# Altium schematic sheet 06 MCU_PORT.SchDoc
size 513 x 386 mm
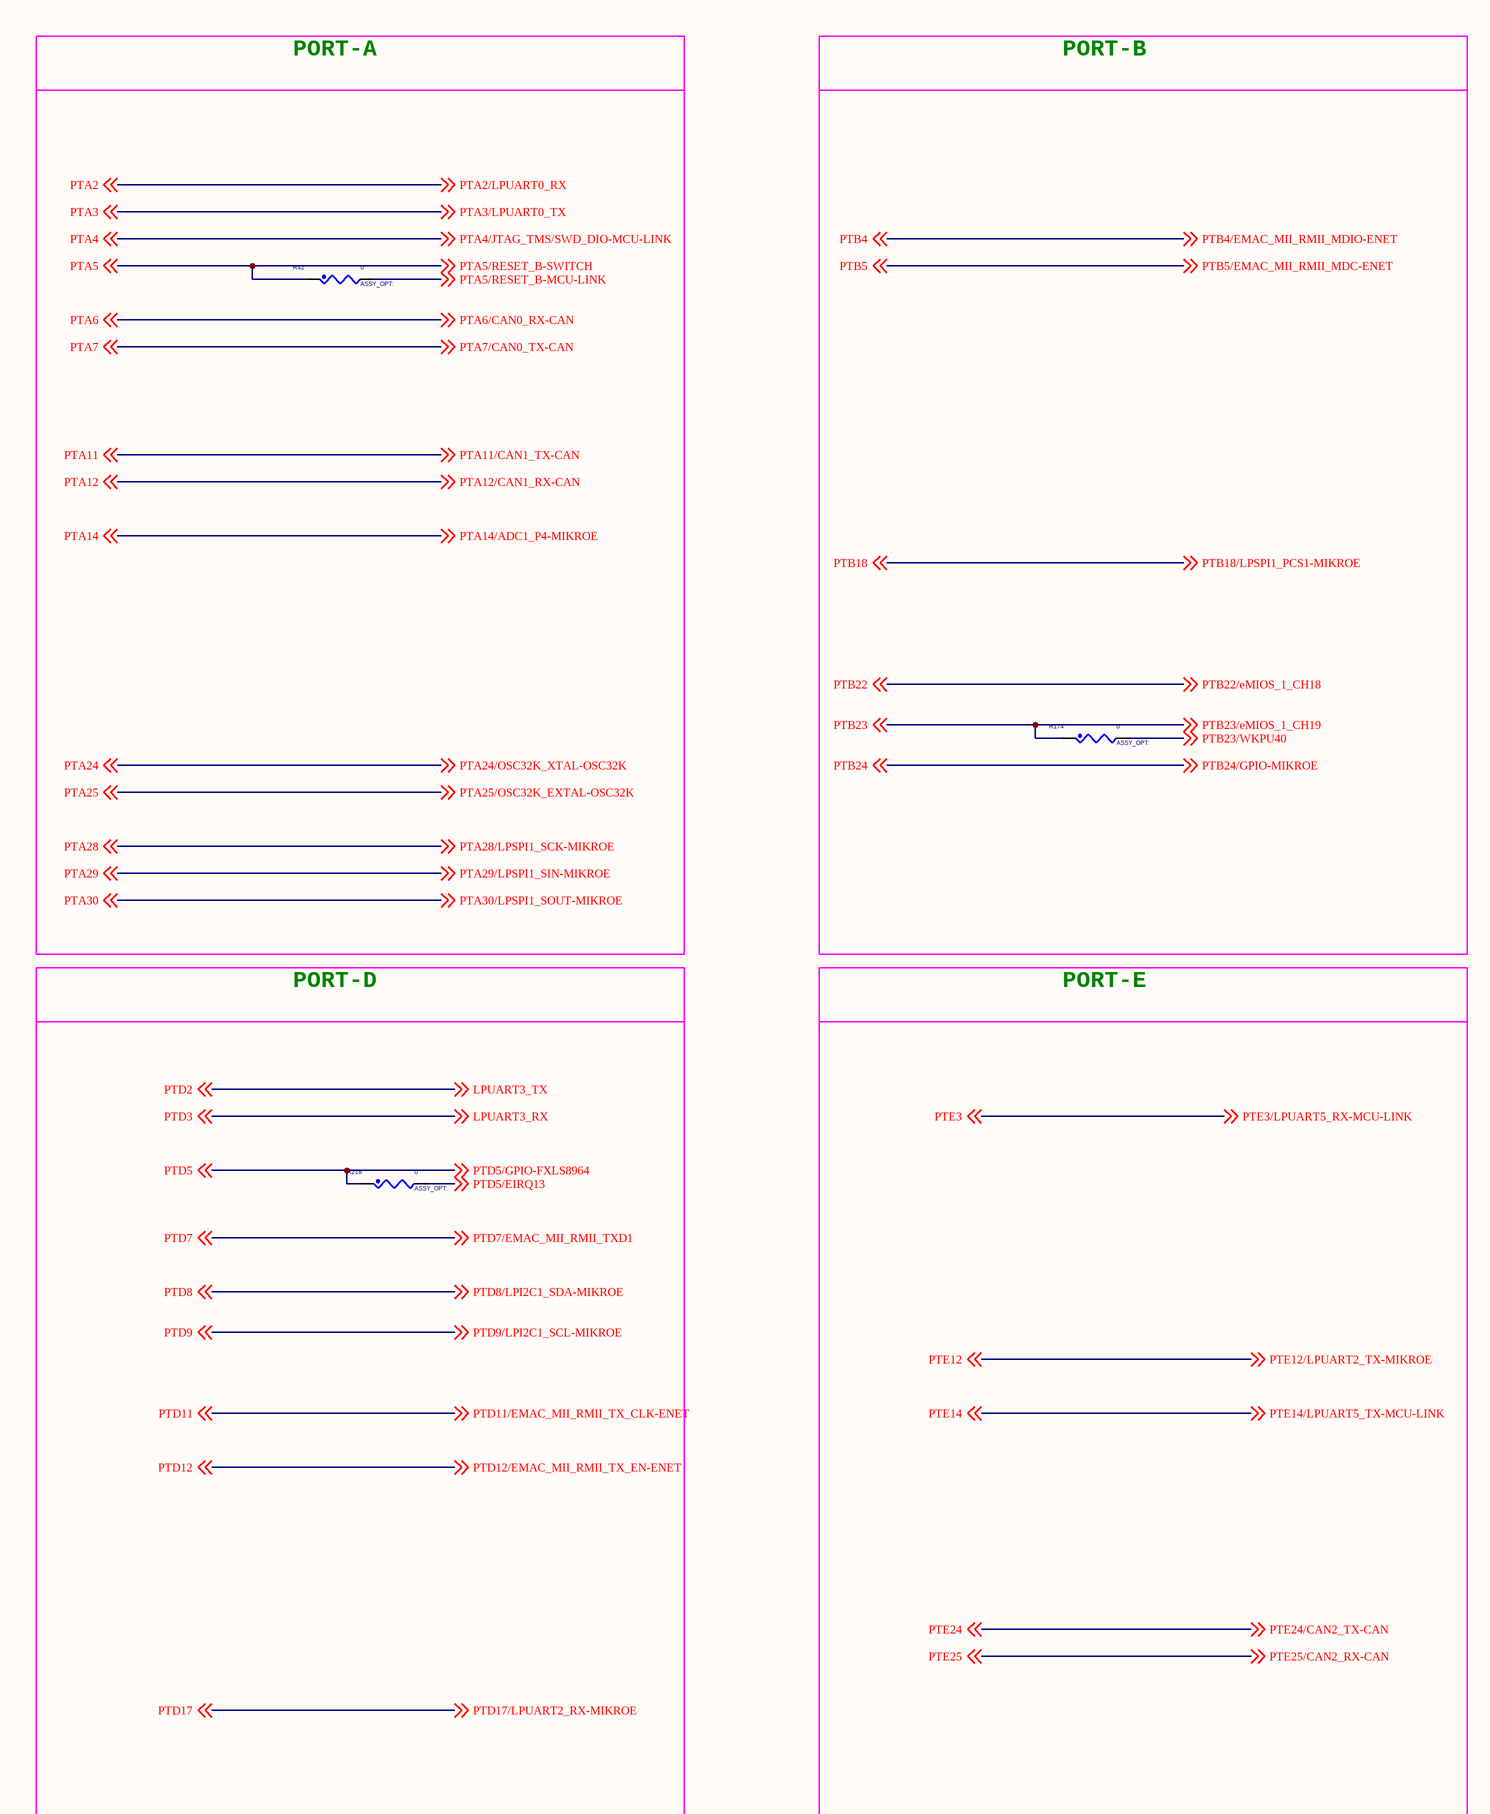
[diagram p0: 06 MCU_PORT.SchDoc, left]
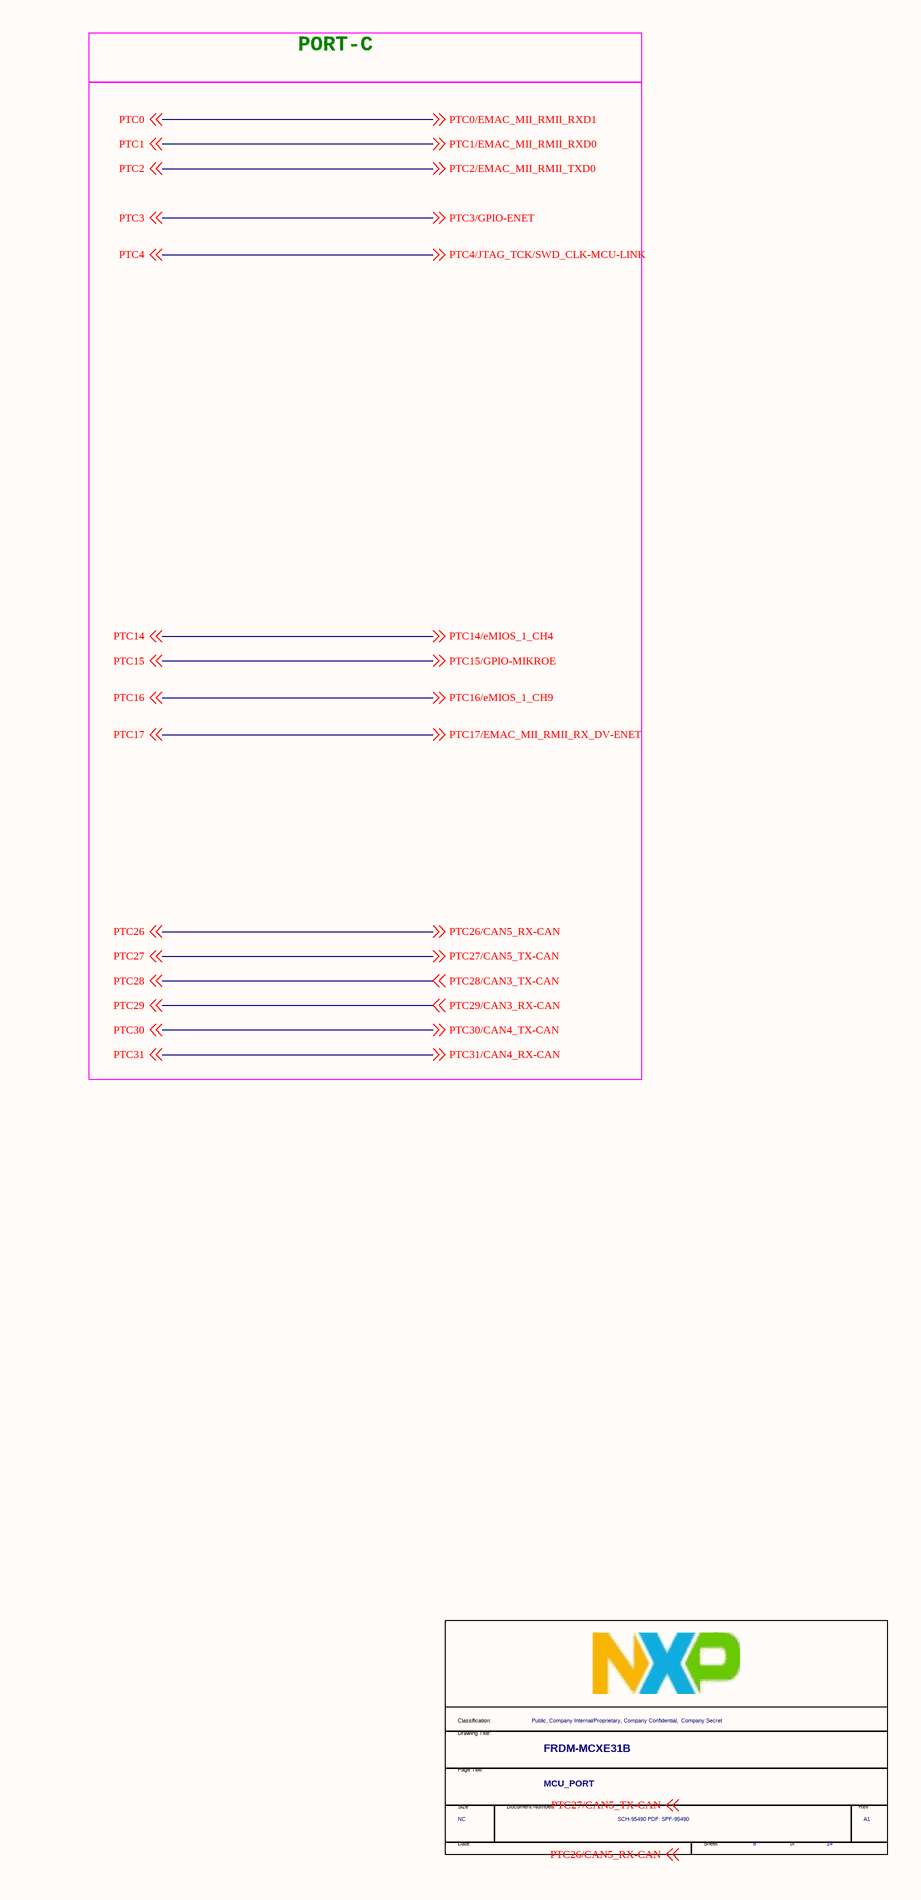
[diagram p1: 06 MCU_PORT.SchDoc, right]

## Parts
*  Title: FRDM-MCXE31B  RevCode: A1  PageTitle: MCU_PORT  Page Size: NC  Page Number: 6  Page Count: 14  Doc: SCH-95490 PDF: SPF-95490  Classification: Public, Company Internal/Proprietary, Company Confidential,  Company Secret  (hidden comment: TitleBlock_FS)  (graphical)
R42  0  [RC0402_25]
R174  0  [RC0603_OV]
R218  0  [RC0603_OV]

## Nets
LPUART3_RX: off-sheet PTD3, off-sheet LPUART3_RX  [also labelled PTD3]
LPUART3_TX: off-sheet PTD2, off-sheet LPUART3_TX  [also labelled PTD2]
PTA2: off-sheet PTA2, off-sheet PTA2/LPUART0_RX  [also labelled PTA2/LPUART0_RX]
PTA3: off-sheet PTA3, off-sheet PTA3/LPUART0_TX  [also labelled PTA3/LPUART0_TX]
PTA4: off-sheet PTA4, off-sheet PTA4/JTAG_TMS/SWD_DIO-MCU-LINK  [also labelled PTA4/JTAG_TMS/SWD_DIO-MCU-LINK]
PTA5: R42.1 ; off-sheet PTA5, off-sheet PTA5/RESET_B-SWITCH  [also labelled PTA5/RESET_B-SWITCH]
PTA5/RESET_B-MCU-LINK: R42.2 ; off-sheet PTA5/RESET_B-MCU-LINK
PTA6: off-sheet PTA6, off-sheet PTA6/CAN0_RX-CAN  [also labelled PTA6/CAN0_RX-CAN]
PTA7: off-sheet PTA7, off-sheet PTA7/CAN0_TX-CAN  [also labelled PTA7/CAN0_TX-CAN]
PTA11: off-sheet PTA11, off-sheet PTA11/CAN1_TX-CAN  [also labelled PTA11/CAN1_TX-CAN]
PTA12: off-sheet PTA12, off-sheet PTA12/CAN1_RX-CAN  [also labelled PTA12/CAN1_RX-CAN]
PTA14: off-sheet PTA14, off-sheet PTA14/ADC1_P4-MIKROE  [also labelled PTA14/ADC1_P4-MIKROE]
PTA24: off-sheet PTA24, off-sheet PTA24/OSC32K_XTAL-OSC32K  [also labelled PTA24/OSC32K_XTAL-OSC32K]
PTA25: off-sheet PTA25, off-sheet PTA25/OSC32K_EXTAL-OSC32K  [also labelled PTA25/OSC32K_EXTAL-OSC32K]
PTA28: off-sheet PTA28, off-sheet PTA28/LPSPI1_SCK-MIKROE  [also labelled PTA28/LPSPI1_SCK-MIKROE]
PTA29: off-sheet PTA29, off-sheet PTA29/LPSPI1_SIN-MIKROE  [also labelled PTA29/LPSPI1_SIN-MIKROE]
PTA30: off-sheet PTA30, off-sheet PTA30/LPSPI1_SOUT-MIKROE  [also labelled PTA30/LPSPI1_SOUT-MIKROE]
PTB4: off-sheet PTB4, off-sheet PTB4/EMAC_MII_RMII_MDIO-ENET  [also labelled PTB4/EMAC_MII_RMII_MDIO-ENET]
PTB5: off-sheet PTB5, off-sheet PTB5/EMAC_MII_RMII_MDC-ENET  [also labelled PTB5/EMAC_MII_RMII_MDC-ENET]
PTB18: off-sheet PTB18, off-sheet PTB18/LPSPI1_PCS1-MIKROE  [also labelled PTB18/LPSPI1_PCS1-MIKROE]
PTB22: off-sheet PTB22, off-sheet PTB22/eMIOS_1_CH18  [also labelled PTB22/eMIOS_1_CH18]
PTB23: R174.1 ; off-sheet PTB23, off-sheet PTB23/eMIOS_1_CH19  [also labelled PTB23/eMIOS_1_CH19]
PTB23/WKPU40: R174.2 ; off-sheet PTB23/WKPU40
PTB24: off-sheet PTB24, off-sheet PTB24/GPIO-MIKROE  [also labelled PTB24/GPIO-MIKROE]
PTC0: off-sheet PTC0, off-sheet PTC0/EMAC_MII_RMII_RXD1  [also labelled PTC0/EMAC_MII_RMII_RXD1]
PTC1: off-sheet PTC1, off-sheet PTC1/EMAC_MII_RMII_RXD0  [also labelled PTC1/EMAC_MII_RMII_RXD0]
PTC2: off-sheet PTC2, off-sheet PTC2/EMAC_MII_RMII_TXD0  [also labelled PTC2/EMAC_MII_RMII_TXD0]
PTC3: off-sheet PTC3, off-sheet PTC3/GPIO-ENET  [also labelled PTC3/GPIO-ENET]
PTC4: off-sheet PTC4, off-sheet PTC4/JTAG_TCK/SWD_CLK-MCU-LINK  [also labelled PTC4/JTAG_TCK/SWD_CLK-MCU-LINK]
PTC14: off-sheet PTC14, off-sheet PTC14/eMIOS_1_CH4  [also labelled PTC14/eMIOS_1_CH4]
PTC15: off-sheet PTC15, off-sheet PTC15/GPIO-MIKROE  [also labelled PTC15/GPIO-MIKROE]
PTC16: off-sheet PTC16, off-sheet PTC16/eMIOS_1_CH9  [also labelled PTC16/eMIOS_1_CH9]
PTC17: off-sheet PTC17, off-sheet PTC17/EMAC_MII_RMII_RX_DV-ENET  [also labelled PTC17/EMAC_MII_RMII_RX_DV-ENET]
PTC26: off-sheet PTC26, off-sheet PTC26/CAN5_RX-CAN  [also labelled PTC26/CAN5_RX-CAN]
PTC27: off-sheet PTC27, off-sheet PTC27/CAN5_TX-CAN  [also labelled PTC27/CAN5_TX-CAN]
PTC28: off-sheet PTC28, off-sheet PTC28/CAN3_TX-CAN  [also labelled PTC28/CAN3_TX-CAN]
PTC29: off-sheet PTC29, off-sheet PTC29/CAN3_RX-CAN  [also labelled PTC29/CAN3_RX-CAN]
PTC30: off-sheet PTC30, off-sheet PTC30/CAN4_TX-CAN  [also labelled PTC30/CAN4_TX-CAN]
PTC31: off-sheet PTC31, off-sheet PTC31/CAN4_RX-CAN  [also labelled PTC31/CAN4_RX-CAN]
PTD5: R218.1 ; off-sheet PTD5, off-sheet PTD5/GPIO-FXLS8964  [also labelled PTD5/GPIO-FXLS8964]
PTD5/EIRQ13: R218.2 ; off-sheet PTD5/EIRQ13
PTD7: off-sheet PTD7, off-sheet PTD7/EMAC_MII_RMII_TXD1  [also labelled PTD7/EMAC_MII_RMII_TXD1]
PTD8: off-sheet PTD8, off-sheet PTD8/LPI2C1_SDA-MIKROE  [also labelled PTD8/LPI2C1_SDA-MIKROE]
PTD9: off-sheet PTD9, off-sheet PTD9/LPI2C1_SCL-MIKROE  [also labelled PTD9/LPI2C1_SCL-MIKROE]
PTD11: off-sheet PTD11, off-sheet PTD11/EMAC_MII_RMII_TX_CLK-ENET  [also labelled PTD11/EMAC_MII_RMII_TX_CLK-ENET]
PTD12: off-sheet PTD12, off-sheet PTD12/EMAC_MII_RMII_TX_EN-ENET  [also labelled PTD12/EMAC_MII_RMII_TX_EN-ENET]
PTD17: off-sheet PTD17, off-sheet PTD17/LPUART2_RX-MIKROE  [also labelled PTD17/LPUART2_RX-MIKROE]
PTE3: off-sheet PTE3, off-sheet PTE3/LPUART5_RX-MCU-LINK  [also labelled PTE3/LPUART5_RX-MCU-LINK]
PTE12: off-sheet PTE12, off-sheet PTE12/LPUART2_TX-MIKROE  [also labelled PTE12/LPUART2_TX-MIKROE]
PTE14: off-sheet PTE14, off-sheet PTE14/LPUART5_TX-MCU-LINK  [also labelled PTE14/LPUART5_TX-MCU-LINK]
PTE24: off-sheet PTE24, off-sheet PTE24/CAN2_TX-CAN  [also labelled PTE24/CAN2_TX-CAN]
PTE25: off-sheet PTE25, off-sheet PTE25/CAN2_RX-CAN  [also labelled PTE25/CAN2_RX-CAN]

## Notes on the sheet
- PORT-A
- PORT-B
- PORT-C
- PORT-D
- PORT-E
- Labels drawn without touching a wire or pin: PTC26/CAN5_RX-CAN, PTC27/CAN5_TX-CAN
- (in symbol TitleBlock_FS) Classification:; Drawing Title:; Page Title:; Size; Document Number; Rev; Date:; Sheet; of

## Library data of the parts
* = TitleBlock_FS: Variant Name: <Core Design>; OrgAddr2: Austin, TX 78735-8598; OrgAddr1: 6501 William Cannon Drive West; OrgName: NXP Semiconductors; Classification: Company Internal/Proprietary; Page Create Date: March  8, 1995
R42 R174 R218 = RES: RES MF ZERO OHM 1/10W -- 0603; CLASS: DISCRETE; Temp Range: –55 °C to +155 °C; VOLTAGE: 1/16W; FPLIST: RC0603_OV,RC0603,R603-X2,r603-x2_b,0603_CC,IND_0603HP_NSP,CC0603_OV_NSP; CAD_APPROVED: Yes; MFG_PN01: CRCW06030000Z0EAC; MFG_NAME01: VISHAY; AGILE_PN: 470-80866; ROHS: NULL; HEIGHT: 0.6